# EAGLE design max9611 (EAGLE 6.3)
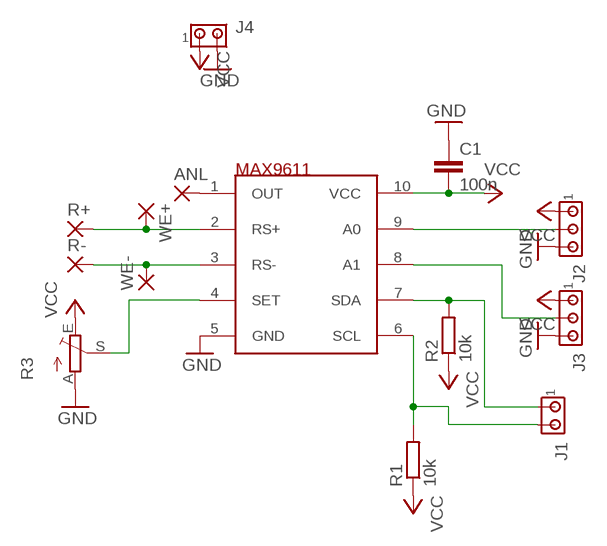
[diagram p0: schematic, sheet 1]

## Parts
ANL  1,6/0,8  [1,6/0,8]
C1  100n  C-EUC0805  [C0805]
J1  MTA02-100  [10X02MTA]
J2  MTA03-100  [10X03MTA]
J3  MTA03-100  [10X03MTA]
J4  MTA02-100  [10X02MTA]
R1  10k  R-EU_M0805  [M0805]
R2  10k  R-EU_M0805  [M0805]
R3  TRIM_EU-RJ9W  [RJ9W]
R+  1,6/0,8  [1,6/0,8]
R-  1,6/0,8  [1,6/0,8]
U$1  MAX9611  [UMAX10]
WE+  1,6/0,8  [1,6/0,8]
WE-  1,6/0,8  [1,6/0,8]

## Nets
GND: C1.1 J2.3 J3.3 J4.2 R3.A U$1.5(GND)
N$1: J2.2 U$1.9(A0)
N$2: J3.2 U$1.8(A1)
N$3: J1.1 R2.2 U$1.7(SDA)
N$4: J1.2 R1.2 U$1.6(SCL)
N$5: ANL.1(P) U$1.1(OUT)
N$6: R3.S U$1.4(SET)
N$7: R+.1(P) U$1.2(RS+) WE+.1(P)
N$8: R-.1(P) U$1.3(RS-) WE-.1(P)
VCC: C1.2 J2.1 J3.1 J4.1 R1.1 R2.1 R3.E U$1.10(VCC)

## Library data of the parts
ANL R+ R- WE+ WE- = wirepad:1,6/0,8: THROUGH-HOLE PAD
C1 = rcl:C-EU: CAPACITOR, European symbol
J1 J4 = con-amp:MTA02-100: AMP connector
J2 J3 = con-amp:MTA03-100: AMP connector
R1 R2 = resistor:R-EU_: RESISTOR, European symbol
R3 = pot:TRIM_EU-: POTENTIOMETER
U$1 = ref-packages:MAX9611

## Net classes
0 default: clearance 0.7 mm

## Board
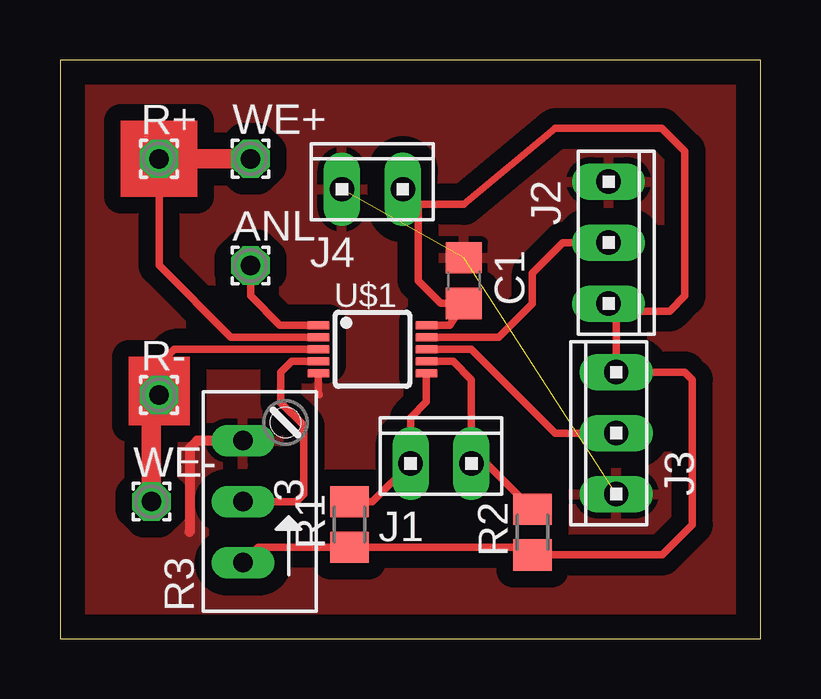
[diagram p1: board, top side]

Size 29.19 x 24.12 mm. Coordinates in mm from the lower left corner, seen from the top.
Outline: 0,0 29.19,0 29.19,24.12 0,24.12 0,0
Copper layers (1*16): Top 0.035mm / dielectric 1.5mm / Bottom 0.035mm
Design rules "default": minimum track width 10mil, minimum drill 24mil, track to track 8mil, track to pad 8mil, pad to pad 8mil, via to via 8mil, smd to smd 8mil, copper to edge 40mil, drill to drill 8mil, minimum pad ring 10mil, minimum via ring 8mil, stop-mask expansion 4mil, vias tented up to drill 0mil, thermal gap 10mil

### Footprints (pad centres in the part's own frame; a part is rotated, then mirrored left to right if it is on the bottom)
1,6/0,8 = drill 0.813 pad 1.6 octagon: 1 0,0
C0805 = smd 1.3 x 1.5: 1 -0.95,0; 2 0.95,0
10X02MTA = drill 1.016 long: 1 1.27,0; 2 -1.27,0
10X03MTA = drill 1.016 long: 1 2.54,0; 2 0,0; 3 -2.54,0
M0805 = smd 1.3 x 1.6: 1 -0.95,0; 2 0.95,0
RJ9W = drill 0.813 long: A 2.54,0.635; E -2.54,0.635; S 0,0.635
UMAX10 = smd 0.32 x 0.9: 1 -1,-2.25; 2 -0.5,-2.25; 3 0,-2.25; 4 0.5,-2.25; 5 1,-2.25; 6 1,2.25; 7 0.5,2.25; 8 0,2.25; 9 -0.5,2.25; 10 -1,2.25

### Placement (x,y rotation side)
ANL  7.94,15.56 0 top
C1  16.83,14.92 270 top
J1  15.88,7.3 0 top
J2  22.86,16.51 270 top
J3  23.18,8.57 90 top
J4  13.02,18.73 0 top
R1  12.07,4.76 90 top
R2  19.69,4.45 90 top
R3  8.26,5.71 90 top
R+  4.13,20 0 top
R-  4.13,10.16 0 top
U$1  13.02,12.07 270 top
WE+  7.94,20 0 top
WE-  3.81,5.71 0 top

### Tracks (layer width: path | path; a pad name or v marks a point on that pad's centre or on a via)
GND  (2 unrouted)
  Top 0.305: U$1.5 10.77,10.19 10.79,10.16
  Top 0.406: R3.A 5.72,8.26 5.4,7.94 5.4,4.45
  pour Top: -4.13,-3.49 35.88,-3.81 35.56,27.3 -4.45,27.62
N$1
  Top 0.305: U$1.9 18.28,12.57 19.69,13.97 19.69,15.24 20.96,16.51 J2.2
N$2
  Top 0.305: U$1.8 17.14,12.07 20.64,8.57 J3.2
N$3
  Top 0.305: R2.2 17.78,7.3 J1.1 17.14,10.79 16.37,11.57 U$1.7
N$4
  Top 0.305: R1.2 13.01,5.71 J1.2 14.6,9.21 15.27,9.87 U$1.6
N$5
  Top 0.305: U$1.1 9.16,13.07 7.94,14.29 ANL.1
N$6
  Top 0.305: U$1.4 9.66,11.57 9.21,11.11 9.21,9.84 10.16,8.89 10.16,6.03 9.84,5.71 R3.S
N$7
  Top 0.305: U$1.2 7.12,12.57 4.13,15.56 R+.1
  Top 0.813: R+.1 WE+.1
N$8
  Top 0.305: U$1.3 4.76,12.07 4.13,11.43 R-.1 3.81,9.84
  Top 0.813: WE-.1 3.81,9.84
VCC
  Top 0.305: U$1.10 16.24,13.07 C1.2 15.87,13.97 14.92,14.92 14.92,18.1 | R3.E 8.26,3.81 R1.1 19.37,3.81 R2.1 25.09,3.5 26.35,4.76 26.35,10.79 26.03,11.11 J3.1 23.18,13.65 | 14.92,18.1 J4.1 | 23.18,13.65 25.4,13.65 26.03,14.29 26.03,20.32 25.08,21.27 20.64,21.27 16.83,18.1 14.92,18.1 | 23.18,13.65 J2.1
(copper drawn outside any net)
  shapes: Top area x2